# EAGLE schematic nk edit (EAGLE 7.4.0)
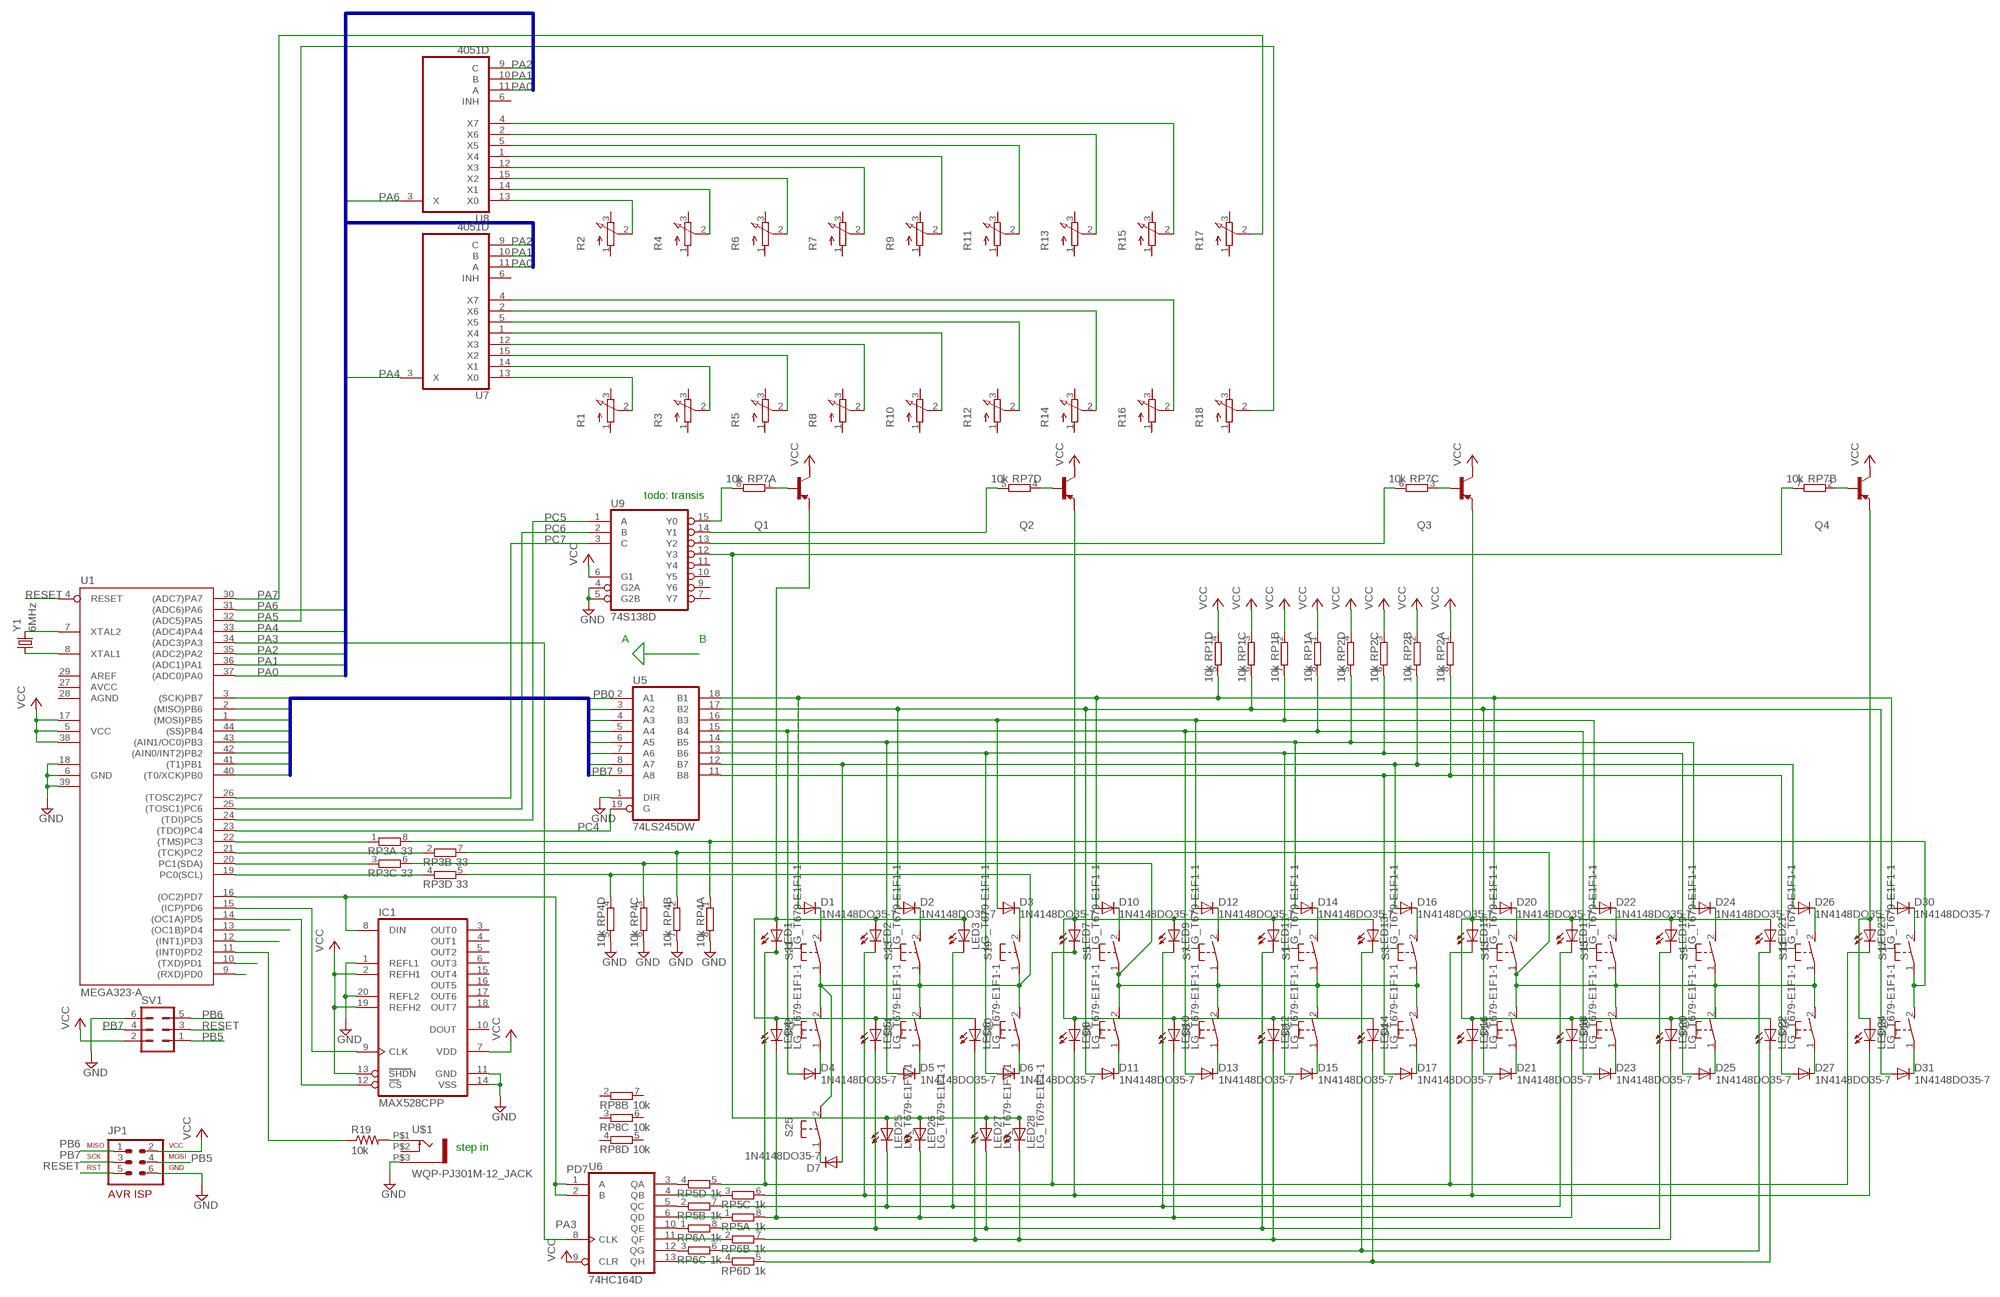
[diagram p0: schematic, sheet 1]

## Parts
D1  1N4148DO35-7  [DO35-7]
D2  1N4148DO35-7  [DO35-7]
D3  1N4148DO35-7  [DO35-7]
D4  1N4148DO35-7  [DO35-7]
D5  1N4148DO35-7  [DO35-7]
D6  1N4148DO35-7  [DO35-7]
D7  1N4148DO35-7  [DO35-7]
D10  1N4148DO35-7  [DO35-7]
D11  1N4148DO35-7  [DO35-7]
D12  1N4148DO35-7  [DO35-7]
D13  1N4148DO35-7  [DO35-7]
D14  1N4148DO35-7  [DO35-7]
D15  1N4148DO35-7  [DO35-7]
D16  1N4148DO35-7  [DO35-7]
D17  1N4148DO35-7  [DO35-7]
D20  1N4148DO35-7  [DO35-7]
D21  1N4148DO35-7  [DO35-7]
D22  1N4148DO35-7  [DO35-7]
D23  1N4148DO35-7  [DO35-7]
D24  1N4148DO35-7  [DO35-7]
D25  1N4148DO35-7  [DO35-7]
D26  1N4148DO35-7  [DO35-7]
D27  1N4148DO35-7  [DO35-7]
D30  1N4148DO35-7  [DO35-7]
D31  1N4148DO35-7  [DO35-7]
IC1  MAX528CPP  [DIL20]
JP1  AVR-ISP-6VERT  [AVR-ISP-6]
LED1  LG_T679-E1F1-1  [PLCC2]
LED2  LG_T679-E1F1-1  [PLCC2]
LED3  LG_T679-E1F1-1  [PLCC2]
LED4  LG_T679-E1F1-1  [PLCC2]
LED5  LG_T679-E1F1-1  [PLCC2]
LED6  LG_T679-E1F1-1  [PLCC2]
LED7  LG_T679-E1F1-1  [PLCC2]
LED8  LG_T679-E1F1-1  [PLCC2]
LED9  LG_T679-E1F1-1  [PLCC2]
LED10  LG_T679-E1F1-1  [PLCC2]
LED11  LG_T679-E1F1-1  [PLCC2]
LED12  LG_T679-E1F1-1  [PLCC2]
LED13  LG_T679-E1F1-1  [PLCC2]
LED14  LG_T679-E1F1-1  [PLCC2]
LED15  LG_T679-E1F1-1  [PLCC2]
LED16  LG_T679-E1F1-1  [PLCC2]
LED17  LG_T679-E1F1-1  [PLCC2]
LED18  LG_T679-E1F1-1  [PLCC2]
LED19  LG_T679-E1F1-1  [PLCC2]
LED20  LG_T679-E1F1-1  [PLCC2]
LED21  LG_T679-E1F1-1  [PLCC2]
LED22  LG_T679-E1F1-1  [PLCC2]
LED23  LG_T679-E1F1-1  [PLCC2]
LED24  LG_T679-E1F1-1  [PLCC2]
LED25  LG_T679-E1F1-1  [PLCC2]
LED26  LG_T679-E1F1-1  [PLCC2]
LED27  LG_T679-E1F1-1  [PLCC2]
LED28  LG_T679-E1F1-1  [PLCC2]
Q1  -PNP-SOT23-BCE  [SOT23-BCE]
Q2  -PNP-SOT23-BCE  [SOT23-BCE]
Q3  -PNP-SOT23-BCE  [SOT23-BCE]
Q4  -PNP-SOT23-BCE  [SOT23-BCE]
R1  3RP/1610N  [3RP/1610N]
R2  3RP/1610N  [3RP/1610N]
R3  3RP/1610N  [3RP/1610N]
R4  3RP/1610N  [3RP/1610N]
R5  3RP/1610N  [3RP/1610N]
R6  3RP/1610N  [3RP/1610N]
R7  3RP/1610N  [3RP/1610N]
R8  3RP/1610N  [3RP/1610N]
R9  3RP/1610N  [3RP/1610N]
R10  3RP/1610N  [3RP/1610N]
R11  3RP/1610N  [3RP/1610N]
R12  3RP/1610N  [3RP/1610N]
R13  3RP/1610N  [3RP/1610N]
R14  3RP/1610N  [3RP/1610N]
R15  3RP/1610N  [3RP/1610N]
R16  3RP/1610N  [3RP/1610N]
R17  3RP/1610N  [3RP/1610N]
R18  3RP/1610N  [3RP/1610N]
R19  10k  R-US_0204/2V  [0204V]
RP1  10k  4R-NEXBS8V  [EXBS8V]
RP2  10k  4R-NEXBS8V  [EXBS8V]
RP3  33  4R-NEXBS8V  [EXBS8V]
RP4  10k  4R-NEXBS8V  [EXBS8V]
RP5  1k  4R-NEXBS8V  [EXBS8V]
RP6  1k  4R-NEXBS8V  [EXBS8V]
RP7  10k  4R-NEXBS8V  [EXBS8V]
RP8  10k  4R-NEXBS8V  [EXBS8V]
S1  31-XX  [B3F-31XX]
S2  31-XX  [B3F-31XX]
S3  31-XX  [B3F-31XX]
S4  31-XX  [B3F-31XX]
S5  31-XX  [B3F-31XX]
S6  31-XX  [B3F-31XX]
S7  31-XX  [B3F-31XX]
S8  31-XX  [B3F-31XX]
S9  31-XX  [B3F-31XX]
S10  31-XX  [B3F-31XX]
S11  31-XX  [B3F-31XX]
S12  31-XX  [B3F-31XX]
S13  31-XX  [B3F-31XX]
S14  31-XX  [B3F-31XX]
S15  31-XX  [B3F-31XX]
S16  31-XX  [B3F-31XX]
S17  31-XX  [B3F-31XX]
S18  31-XX  [B3F-31XX]
S19  31-XX  [B3F-31XX]
S20  31-XX  [B3F-31XX]
S21  31-XX  [B3F-31XX]
S22  31-XX  [B3F-31XX]
S23  31-XX  [B3F-31XX]
S24  31-XX  [B3F-31XX]
S25  31-XX  [B3F-31XX]
SV1  MA03-2  [MA03-2]
U1  MEGA323-A  [TQFP44]
U5  74LS245DW  [SO20W]
U6  74HC164D  [SO14]
U7  4051D  [SO16]
U8  4051D  [SO16]
U9  74S138D  [SO16]
U$1  WQP-PJ301M-12_JACK  [WQP-PJ301M-12_JACK]
Y1  6MHz  CRYSTALHC18U-V  [HC18U-V]

## Nets
GND: IC1.1(REFL1) IC1.11(GND) IC1.14(VSS) IC1.20(REFL2) JP1.6 RP4.5 RP4.6 RP4.7 RP4.8 SV1.6 U1.6(GND) U1.18(GND1) U1.39(GND2) U5.1(DIR) U9.4(G2A) U9.5(G2B) U$1.P$3
N$1: D14.C S1.2(S)
N$2: D15.C S2.1(P)
N$3: D3.C S19.2(S)
N$4: D16.C S3.2(S)
N$5: D17.C S4.1(P)
N$6: RP3.6 RP4.3 S1.1(P) S2.2(S) S3.1(P) S4.2(S) S5.1(P) S6.2(S) S7.1(P) S8.2(S)
N$7: D10.C S5.2(S)
N$8: D11.C S6.1(P)
N$9: D6.C S20.1(P)
N$10: D12.C S7.2(S)
N$11: D13.C S8.1(P)
N$12: RP7.5 U9.14(Y1)
N$13: D24.C S9.2(S)
N$14: D25.C S10.1(P)
N$15: D1.C S21.2(S)
N$16: D26.C S11.2(S)
N$17: D27.C S12.1(P)
N$18: RP3.7 RP4.2 S9.1(P) S10.2(S) S11.1(P) S12.2(S) S13.1(P) S14.2(S) S15.1(P) S16.2(S)
N$19: D20.C S13.2(S)
N$20: D21.C S14.1(P)
N$21: D4.C S22.1(P)
N$22: D22.C S15.2(S)
N$23: D23.C S16.1(P)
N$24: D2.C S23.2(S)
N$25: D30.C S17.2(S)
N$26: D31.C S18.1(P)
N$27: RP3.8 RP4.1 S17.1(P) S18.2(S)
N$28: D5.C S24.1(P)
N$29: D7.C S25.1(P)
N$30: RP3.5 RP4.4 S19.1(P) S20.2(S) S21.1(P) S22.2(S) S23.1(P) S24.2(S) S25.2(S)
N$31: D2.A D11.A D21.A D31.A RP1.6 U5.17(B2)
N$32: D3.A D12.A D22.A RP1.7 U5.16(B3)
N$33: D4.A D13.A D23.A RP1.8 U5.15(B4)
N$34: D5.A D14.A D24.A RP2.5 U5.14(B5)
N$35: D6.A D15.A D25.A RP2.6 U5.13(B6)
N$36: D7.A D16.A D26.A RP2.7 U5.12(B7)
N$37: D17.A D27.A RP2.8 U5.11(B8)
N$38: Q2.B RP7.4
N$40: R19.1 U1.11((INT0)PD2)
N$41: RP7.6 U9.13(Y2)
N$42: Q3.B RP7.3
N$43: U1.12((INT1)PD3)
N$44: Q4.B RP7.2
N$45: U1.10((TXD)PD1)
N$46: U1.9((RXD)PD0)
N$47: U1.7(XTAL2) Y1.2
N$48: RP3.1 U1.22((TMS)PC3)
N$49: RP3.2 U1.21((TCK)PC2)
N$50: RP3.3 U1.20(PC1(SDA))
N$51: RP3.4 U1.19(PC0(SCL))
N$52: LED23.A LED24.A Q4.E
N$53: R19.2 U$1.P$1
N$54: LED1.A LED2.A LED3.A LED4.A LED5.A LED6.A Q1.E
N$58: RP5.4 U6.3(QA)
N$59: RP5.3 U6.4(QB)
N$60: RP5.2 U6.5(QC)
N$61: RP5.1 U6.6(QD)
N$62: RP6.1 U6.10(QE)
N$63: RP6.2 U6.11(QF)
N$64: RP6.3 U6.12(QG)
N$65: RP6.4 U6.13(QH)
N$66: LED1.C LED7.C LED15.C LED23.C RP5.5
N$67: LED2.C LED8.C LED16.C LED24.C RP5.6
N$68: LED3.C LED9.C LED17.C LED25.C RP5.7
N$69: LED4.C LED10.C LED18.C LED26.C RP5.8
N$70: LED5.C LED11.C LED19.C LED27.C RP6.8
N$71: LED6.C LED12.C LED20.C LED28.C RP6.7
N$72: LED7.A LED8.A LED9.A LED10.A LED11.A LED12.A LED13.A LED14.A Q2.E
N$73: LED13.C LED21.C RP6.6
N$74: LED14.C LED22.C RP6.5
N$75: LED15.A LED16.A LED17.A LED18.A LED19.A LED20.A LED21.A LED22.A Q3.E
N$76: LED25.A LED26.A LED27.A LED28.A RP7.7 U9.12(Y3)
N$78: D1.A D10.A D20.A D30.A RP1.5 U5.18(B1)
N$84: R11.2(S) U8.5(X5)
N$85: R2.2(S) U8.13(X0)
N$86: R4.2(S) U8.14(X1)
N$87: R6.2(S) U8.15(X2)
N$88: R7.2(S) U8.12(X3)
N$89: R9.2(S) U8.1(X4)
N$90: R13.2(S) U8.2(X6)
N$91: R15.2(S) U8.4(X7)
N$92: R1.2(S) U7.13(X0)
N$93: R3.2(S) U7.14(X1)
N$94: R5.2(S) U7.15(X2)
N$95: R8.2(S) U7.12(X3)
N$96: R10.2(S) U7.1(X4)
N$97: R12.2(S) U7.5(X5)
N$98: R14.2(S) U7.2(X6)
N$99: R16.2(S) U7.4(X7)
N$100: U1.8(XTAL1) Y1.1
N$107: Q1.B RP7.1
N$108: RP7.8 U9.15(Y0)
PA0: U1.37((ADC0)PA0) U7.11(A) U8.11(A)
PA1: U1.36((ADC1)PA1) U7.10(B) U8.10(B)
PA2: U1.35((ADC2)PA2) U7.9(C) U8.9(C)
PA3: U1.34((ADC3)PA3) U6.8(CLK)
PA4: U1.33((ADC4)PA4) U7.3(X)
PA5: R18.2(S) U1.32((ADC5)PA5)
PA6: U1.31((ADC6)PA6) U8.3(X)
PA7: R17.2(S) U1.30((ADC7)PA7)
PB0: U1.40((T0/XCK)PB0) U5.2(A1)
PB1: U1.41((T1)PB1) U5.3(A2)
PB2: U1.42((AIN0/INT2)PB2) U5.4(A3)
PB3: U1.43((AIN1/OC0)PB3) U5.5(A4)
PB4: U1.44((SS)PB4) U5.6(A5)
PB5: JP1.4 SV1.1 U1.1((MOSI)PB5) U5.7(A6)
PB6: JP1.1 SV1.5 U1.2((MISO)PB6) U5.8(A7)
PB7: JP1.3 SV1.4 U1.3((SCK)PB7) U5.9(A8)
PC4: U1.23((TDO)PC4) U5.19(G)
PC5: U1.24((TDI)PC5) U9.1(A)
PC6: U1.25((TOSC1)PC6) U9.2(B)
PC7: U1.26((TOSC2)PC7) U9.3(C)
PD4: U1.13((OC1B)PD4)
PD5: IC1.12(CS) U1.14((OC1A)PD5)
PD6: IC1.9(CLK) U1.15((ICP)PD6)
PD7: IC1.8(DIN) U1.16((OC2)PD7) U6.1(A) U6.2(B)
RESET: JP1.5 SV1.3 U1.4(RESET)
VCC: IC1.2(REFH1) IC1.7(VDD) IC1.13(SHDN) IC1.19(REFH2) JP1.2 Q1.C Q2.C Q3.C Q4.C RP1.1 RP1.2 RP1.3 RP1.4 RP2.1 RP2.2 RP2.3 RP2.4 SV1.2 U1.5(VCC) U1.17(VCC1) U1.38(VCC2) U6.9(CLR) U9.6(G1)
Unconnected: IC1.3(OUT0) IC1.4(OUT1) IC1.5(OUT2) IC1.6(OUT3) IC1.10(DOUT) IC1.15(OUT4) IC1.16(OUT5) IC1.17(OUT6) IC1.18(OUT7) R1.1(A) R1.3(E) R2.1(A) R2.3(E) R3.1(A) R3.3(E) R4.1(A) R4.3(E) R5.1(A) R5.3(E) R6.1(A) R6.3(E) R7.1(A) R7.3(E) R8.1(A) R8.3(E) R9.1(A) R9.3(E) R10.1(A) R10.3(E) R11.1(A) R11.3(E) R12.1(A) R12.3(E) R13.1(A) R13.3(E) R14.1(A) R14.3(E) R15.1(A) R15.3(E) R16.1(A) R16.3(E) R17.1(A) R17.3(E) R18.1(A) R18.3(E) RP8.1 RP8.2 RP8.3 RP8.4 RP8.5 RP8.6 RP8.7 RP8.8 U1.29(AREF) U7.6(INH) U8.6(INH) U9.7(Y7) U9.9(Y6) U9.10(Y5) U9.11(Y4) U$1.P$2

## Buses
PB[0..7]
PA[0..7]

## Notes on the sheet
- todo: transis
- A | B
- step in

## Power pins joined to a net without a drawn wire
AGND: U1.28(AGND)
AVCC: U1.27(AVCC)
GND: U5.10(GND) U6.7(GND) U7.8(GND) U8.8(GND) U9.8(GND)
VCC: U5.20(VCC) U6.14(VCC) U7.16(VCC) U8.16(VCC) U9.16(VCC)
VEE: U7.7(VEE) U8.7(VEE)

## Library data of the parts
D1-D7 D10-D17 D20-D27 D30 D31 = diode:1N4148: DIODE high speed (Philips)
IC1 = maxim:MAX528CPP: DIGITAL/ANALOG CONVERTER; MPN: MAX528CPP; OC_FARNELL: 1379992; OC_NEWARK: 78C2818
JP1 = avr-7:AVR-ISP-6: AVR ISP-6 Serial Programming Header
LED1-LED28 = led:*_T679-?-1: LC TOPLED® Low Current LED Source: http://catalog.osram-os.com .. LG_LS_LY_T679_OBS.pdf; COLOR: green
Q1-Q4 = transistor:*-PNP-: PNP Transistror
R1-R18 = pot:3RP/1610N: 16mm Potentiometer one level Source: http://www.alphapotentiometers.net/html/16mm_pot_2.html
R19 = rcl:R-US_: RESISTOR, American symbol
RP1-RP8 = resistor-dil:4R-N: Array Chip Resistor Source: RS Component / Phycomp; OC_FARNELL: unknown; OC_NEWARK: unknown
S1-S25 = switch-omron:31-XX: OMRON SWITCH; MPN: B3F-3100; OC_FARNELL: 959704; OC_NEWARK: 36M3582
SV1 = con-lstb:MA03-2: PIN HEADER; OC_FARNELL: unknown; OC_NEWARK: unknown
U1 = atmel:MEGA323: MICROCONTROLLER 32 Kbytes FLASH 2 Kbytes SRAM 1 Kbytes EEPROM USART 8-channel 10 bit ADC Source: avr.lbr; OC_FARNELL: unknown; OC_NEWARK: unknown
U5 = 74xx-us:74*245: Octal BUS TRANSCEIVER, 3-state
U6 = 74xx-us:74*164: 8-bit parallel out SHIFT REGISTER
U7 U8 = 40xx:4051: 8-channel ANALOG MULTIPLEXER
U9 = 74xx-us:74*138: 3-line to 8-line DECODER/DEMULTIPLEXER
U$1 = thonkiconn:WQP-PJ301M-12_JACK
Y1 = crystal:CRYSTAL: CRYSTAL; OC_FARNELL: unknown; OC_NEWARK: unknown